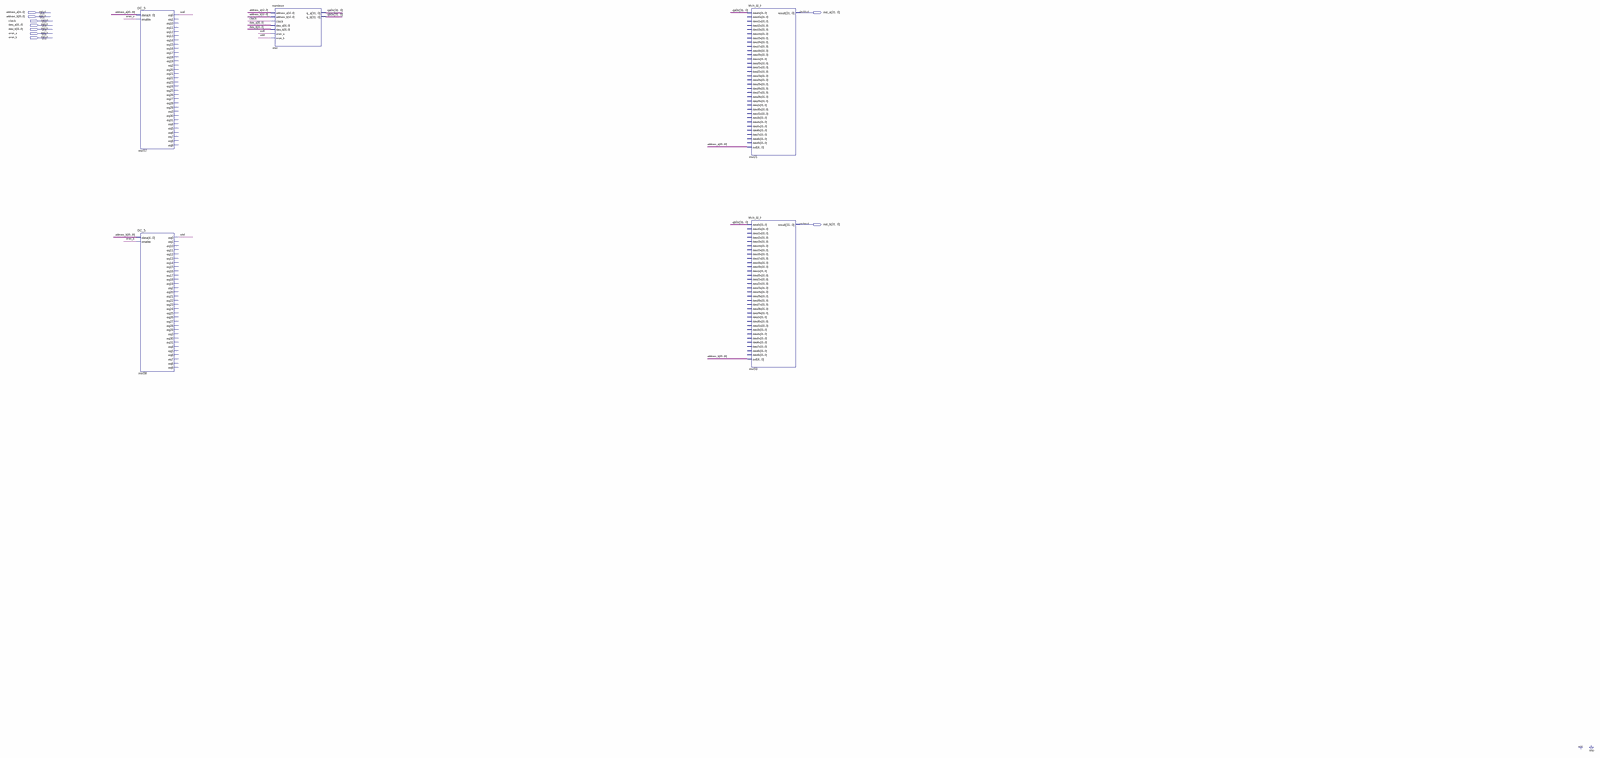
[diagram p0: schematic sheet, whole]
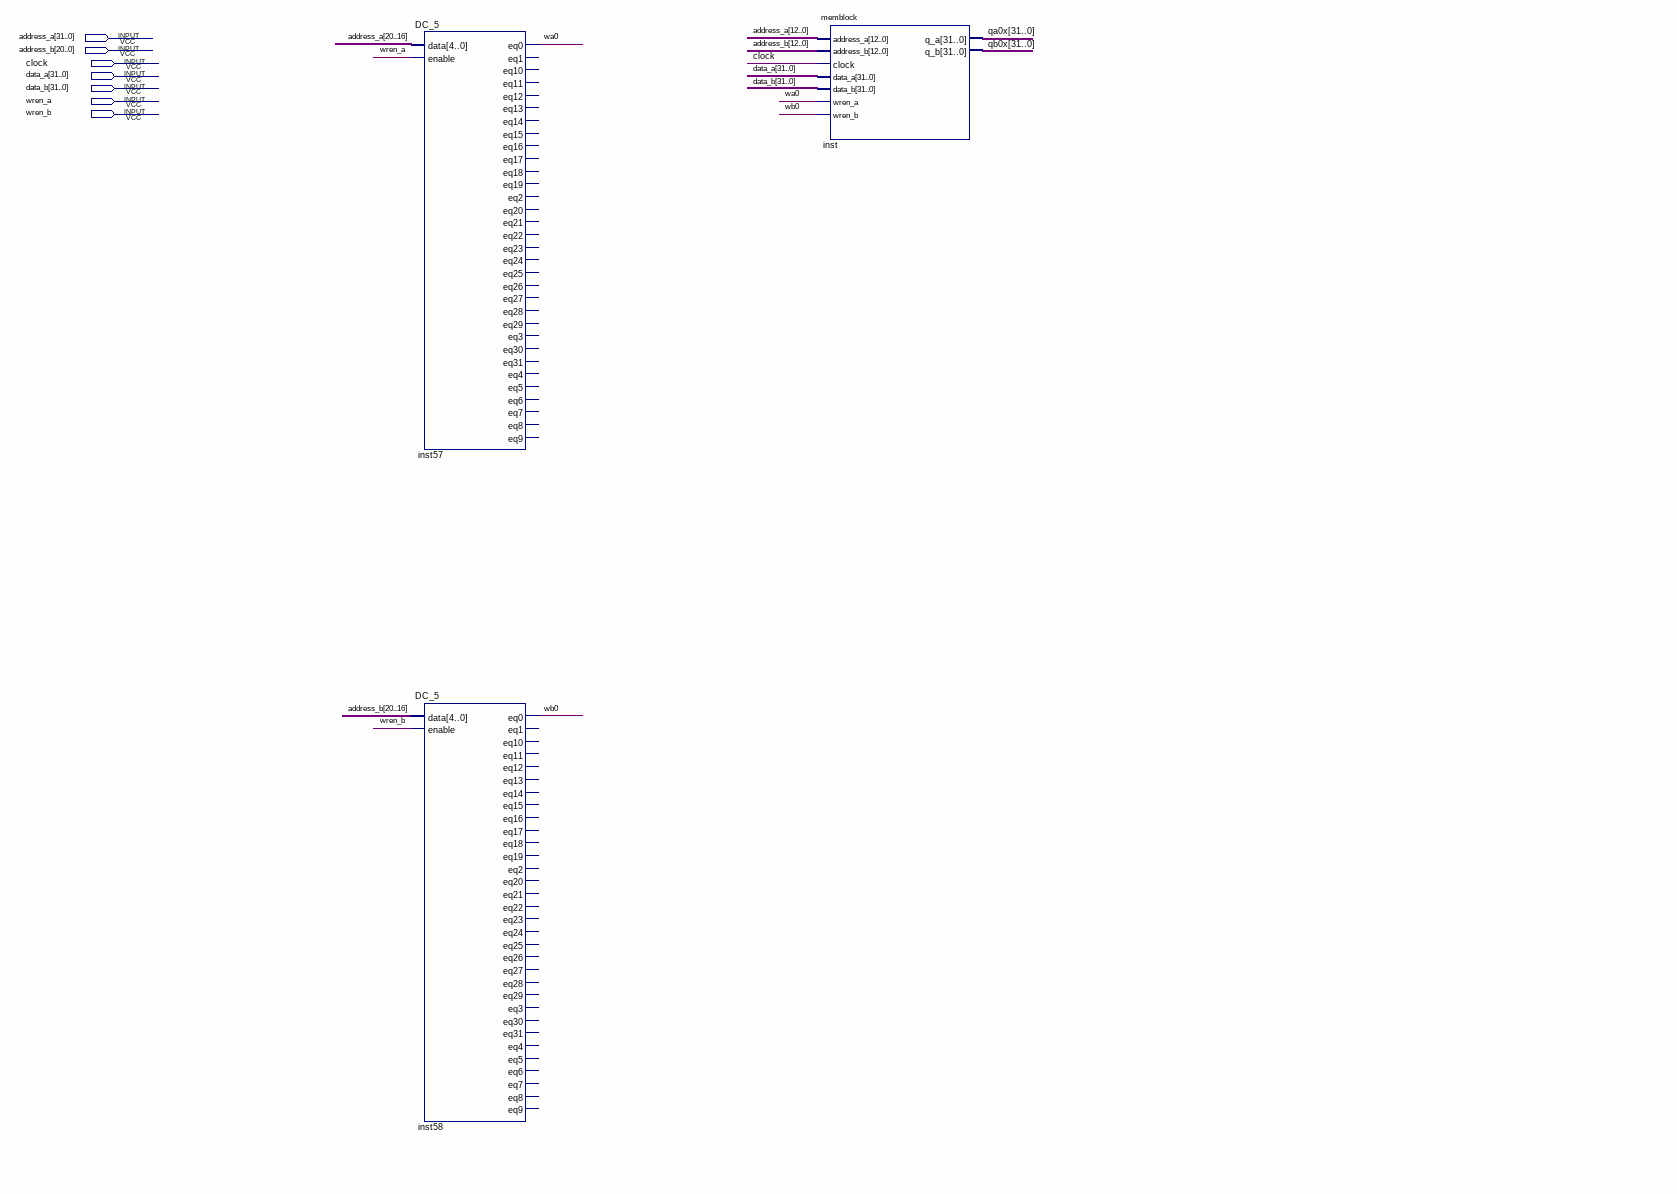
[diagram p1: schematic sheet, upper left part]
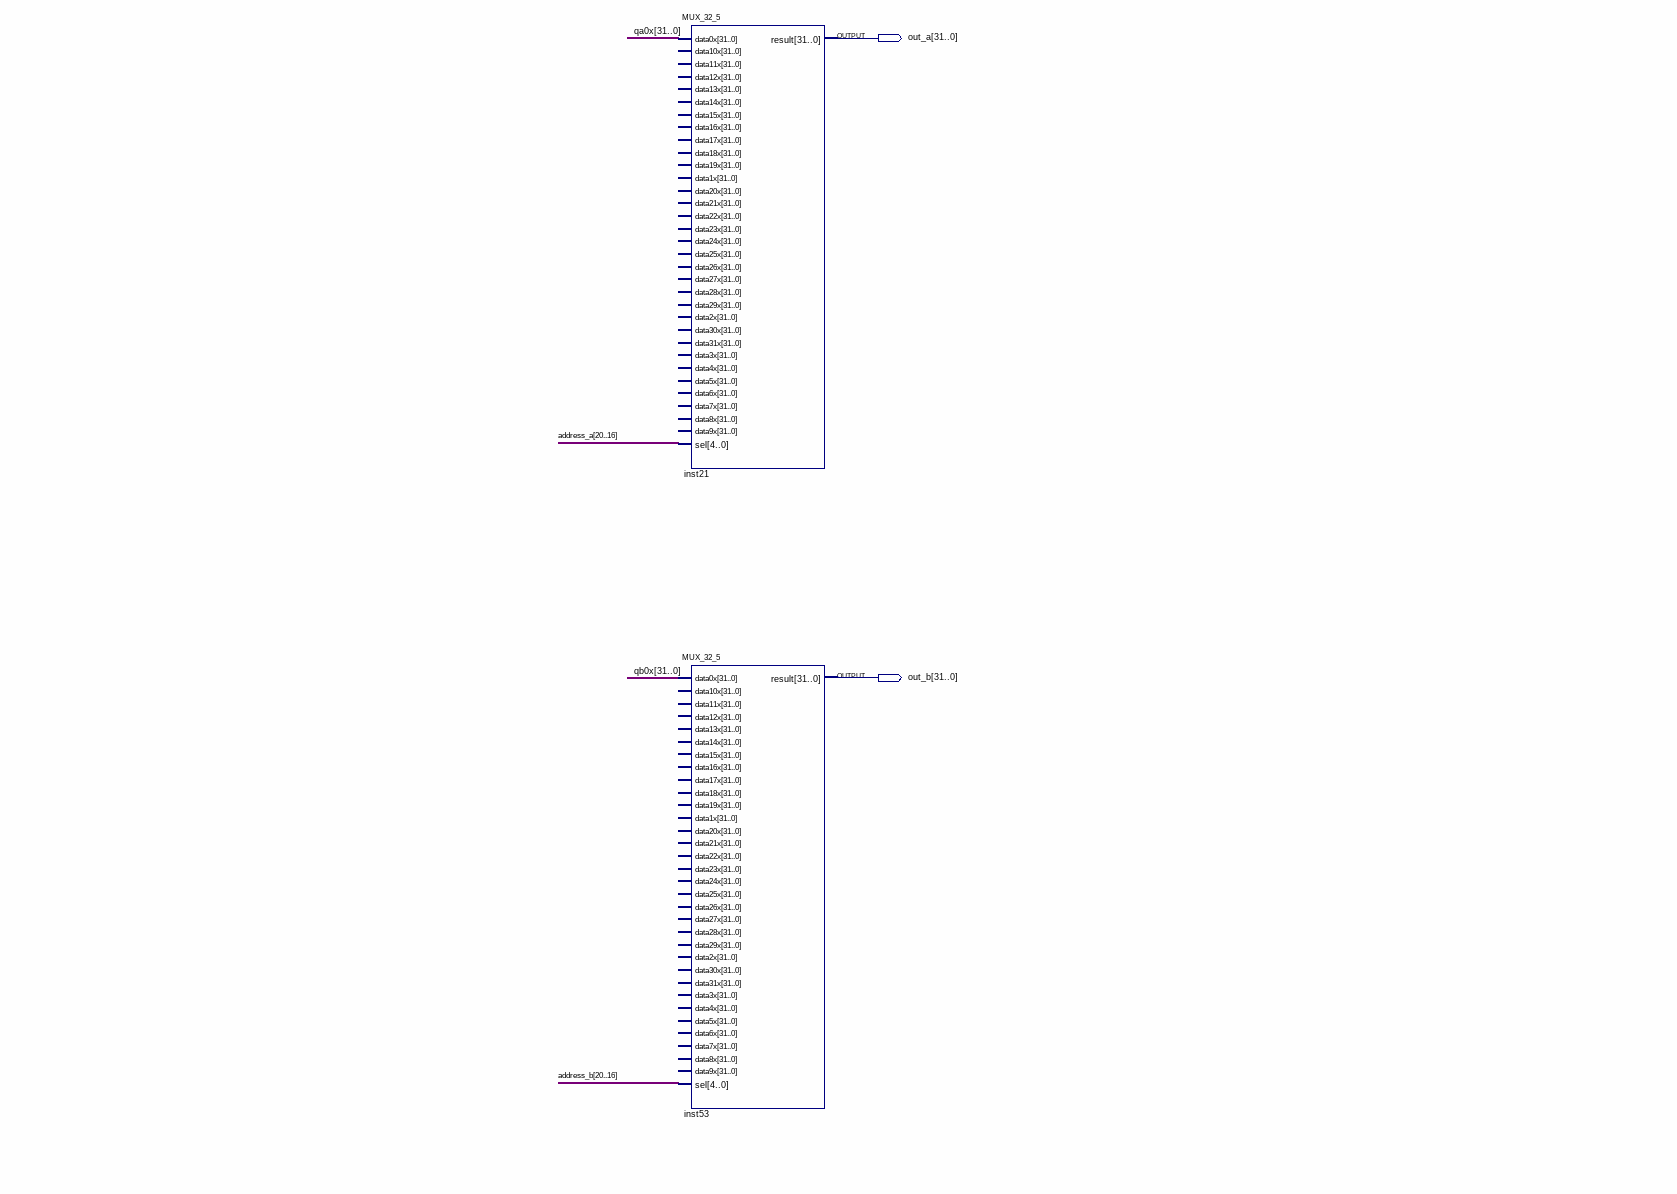
[diagram p2: schematic sheet, upper centre part]
// Quartus schematic 4B_8MB.bdf as structural Verilog: 5 symbols, 9 pins
module \4B_8MB  (
  input  [31:0] address_a,
  input  [20:0] address_b,
  input  clock,
  input  [31:0] data_a,
  input  [31:0] data_b,
  input  wren_a,
  input  wren_b,
  output [31:0] out_a,
  output [31:0] out_b
);

  wire wa0, wb0;
  wire [31:0] qa0x, qb0x;

  DC_5 inst57 (
    .data(address_a[20:16]), .enable(wren_a), .eq0(wa0));  // open: eq1, eq10, eq11, eq12, eq13, eq14, eq15, eq16, eq17, eq18, eq19, eq2, eq20, eq21, eq22, eq23, eq24, eq25, eq26, eq27, eq28, eq29, eq3, eq30, eq31, eq4, eq5, eq6, eq7, eq8, eq9
  DC_5 inst58 (
    .data(address_b[20:16]), .enable(wren_b), .eq0(wb0));  // open: eq1, eq10, eq11, eq12, eq13, eq14, eq15, eq16, eq17, eq18, eq19, eq2, eq20, eq21, eq22, eq23, eq24, eq25, eq26, eq27, eq28, eq29, eq3, eq30, eq31, eq4, eq5, eq6, eq7, eq8, eq9
  memblock inst (
    .address_a(address_a[12:0]), .address_b(address_b[12:0]), .clock(clock), .data_a(data_a),
    .data_b(data_b), .wren_a(wa0), .wren_b(wb0), .q_a(qa0x), .q_b(qb0x));
  MUX_32_5 inst21 (
    .data0x(qa0x), .sel(address_a[20:16]), .result(out_a));  // open: data10x, data11x, data12x, data13x, data14x, data15x, data16x, data17x, data18x, data19x, data1x, data20x, data21x, data22x, data23x, data24x, data25x, data26x, data27x, data28x, data29x, data2x, data30x, data31x, data3x, data4x, data5x, data6x, data7x, data8x, data9x
  MUX_32_5 inst53 (
    .data0x(qb0x), .sel(address_b[20:16]), .result(out_b));  // open: data10x, data11x, data12x, data13x, data14x, data15x, data16x, data17x, data18x, data19x, data1x, data20x, data21x, data22x, data23x, data24x, data25x, data26x, data27x, data28x, data29x, data2x, data30x, data31x, data3x, data4x, data5x, data6x, data7x, data8x, data9x
endmodule
